# EAGLE design SMS-3923-081-breakout (EAGLE 9.4.1)
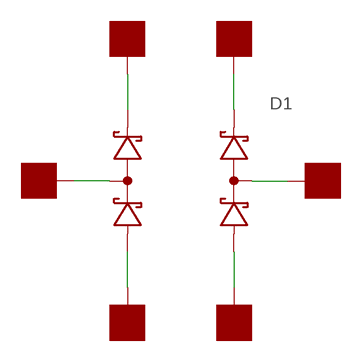
[diagram p0: schematic, sheet 1]

## Parts
D1  SMS3923-081  [SC-88]
U$1  PAD50MIL  [PAD_50MIL]
U$2  PAD50MIL  [PAD_50MIL]
U$3  PAD50MIL  [PAD_50MIL]
U$4  PAD50MIL  [PAD_50MIL]
U$5  PAD50MIL  [PAD_50MIL]
U$6  PAD50MIL  [PAD_50MIL]

## Nets
N$1: D1.4(CATHODE1) U$2.P$1
N$2: D1.3(CATHODE0) U$1.P$1
N$3: D1.2(COMMON0) U$5.P$1
N$4: D1.1(ANODE0) U$4.P$1
N$5: D1.6(ANODE1) U$3.P$1
N$6: D1.5(COMMON1) U$6.P$1

## Library data of the parts
D1 = yapo:SMS3923-081
U$1-U$6 = yapo:PAD

## Board
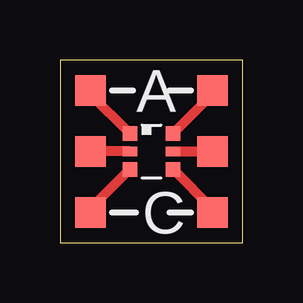
[diagram p1: board, top side]

Size 7.62 x 7.62 mm. Coordinates in mm from the lower left corner, seen from the top.
Outline: 0,0 7.62,0 7.62,7.62 0,7.62 0,0
Copper layers (1*16): Top 0.035559375mm / dielectric 1.6mm / Bottom 0.035559375mm
Design rules "oshpark-2layer": minimum track width 6mil, minimum drill 10mil, track to track 6mil, track to pad 6mil, pad to pad 6mil, via to via 6mil, smd to smd 6mil, copper to edge 15mil, drill to drill 6mil, minimum pad ring 5mil, minimum via ring 5mil, stop-mask expansion 2.5mil, vias tented up to drill 0mil, thermal gap 10mil

### Footprints (pad centres in the part's own frame; a part is rotated, then mirrored left to right if it is on the bottom)
SC-88 = smd 0.6 x 0.6: 1 -0.9,0.75; 3 -0.9,-0.75; 4 0.9,-0.75; 6 0.9,0.75 | smd 0.6 x 0.4: 2 -0.9,0; 5 0.9,0
PAD_50MIL = smd 1.27 x 1.27: P$1 0,0

### Placement (x,y rotation side)
D1  3.81,3.81 0 top
U$1  1.27,1.27 0 top
U$2  6.35,1.27 0 top
U$3  6.35,6.35 0 top
U$4  1.27,6.35 0 top
U$5  1.27,3.81 0 top
U$6  6.35,3.81 0 top

### Tracks (layer width: path | path; a pad name or v marks a point on that pad's centre or on a via)
N$1
  Top 0.406: D1.4 6.35,1.42 U$2.P$1
N$2
  Top 0.406: D1.3 1.27,1.42 U$1.P$1
N$3
  Top 0.406: D1.2 U$5.P$1
N$4
  Top 0.406: D1.1 1.27,6.2 U$4.P$1
N$5
  Top 0.406: D1.6 6.35,6.2 U$3.P$1
N$6
  Top 0.406: D1.5 U$6.P$1

### Text on the board
tPlace: A | C